# EAGLE design eeZeeTiny43U (EAGLE 7.1.0)
DATABASE: ./../../../EAGLE/PARTSDB.TXT
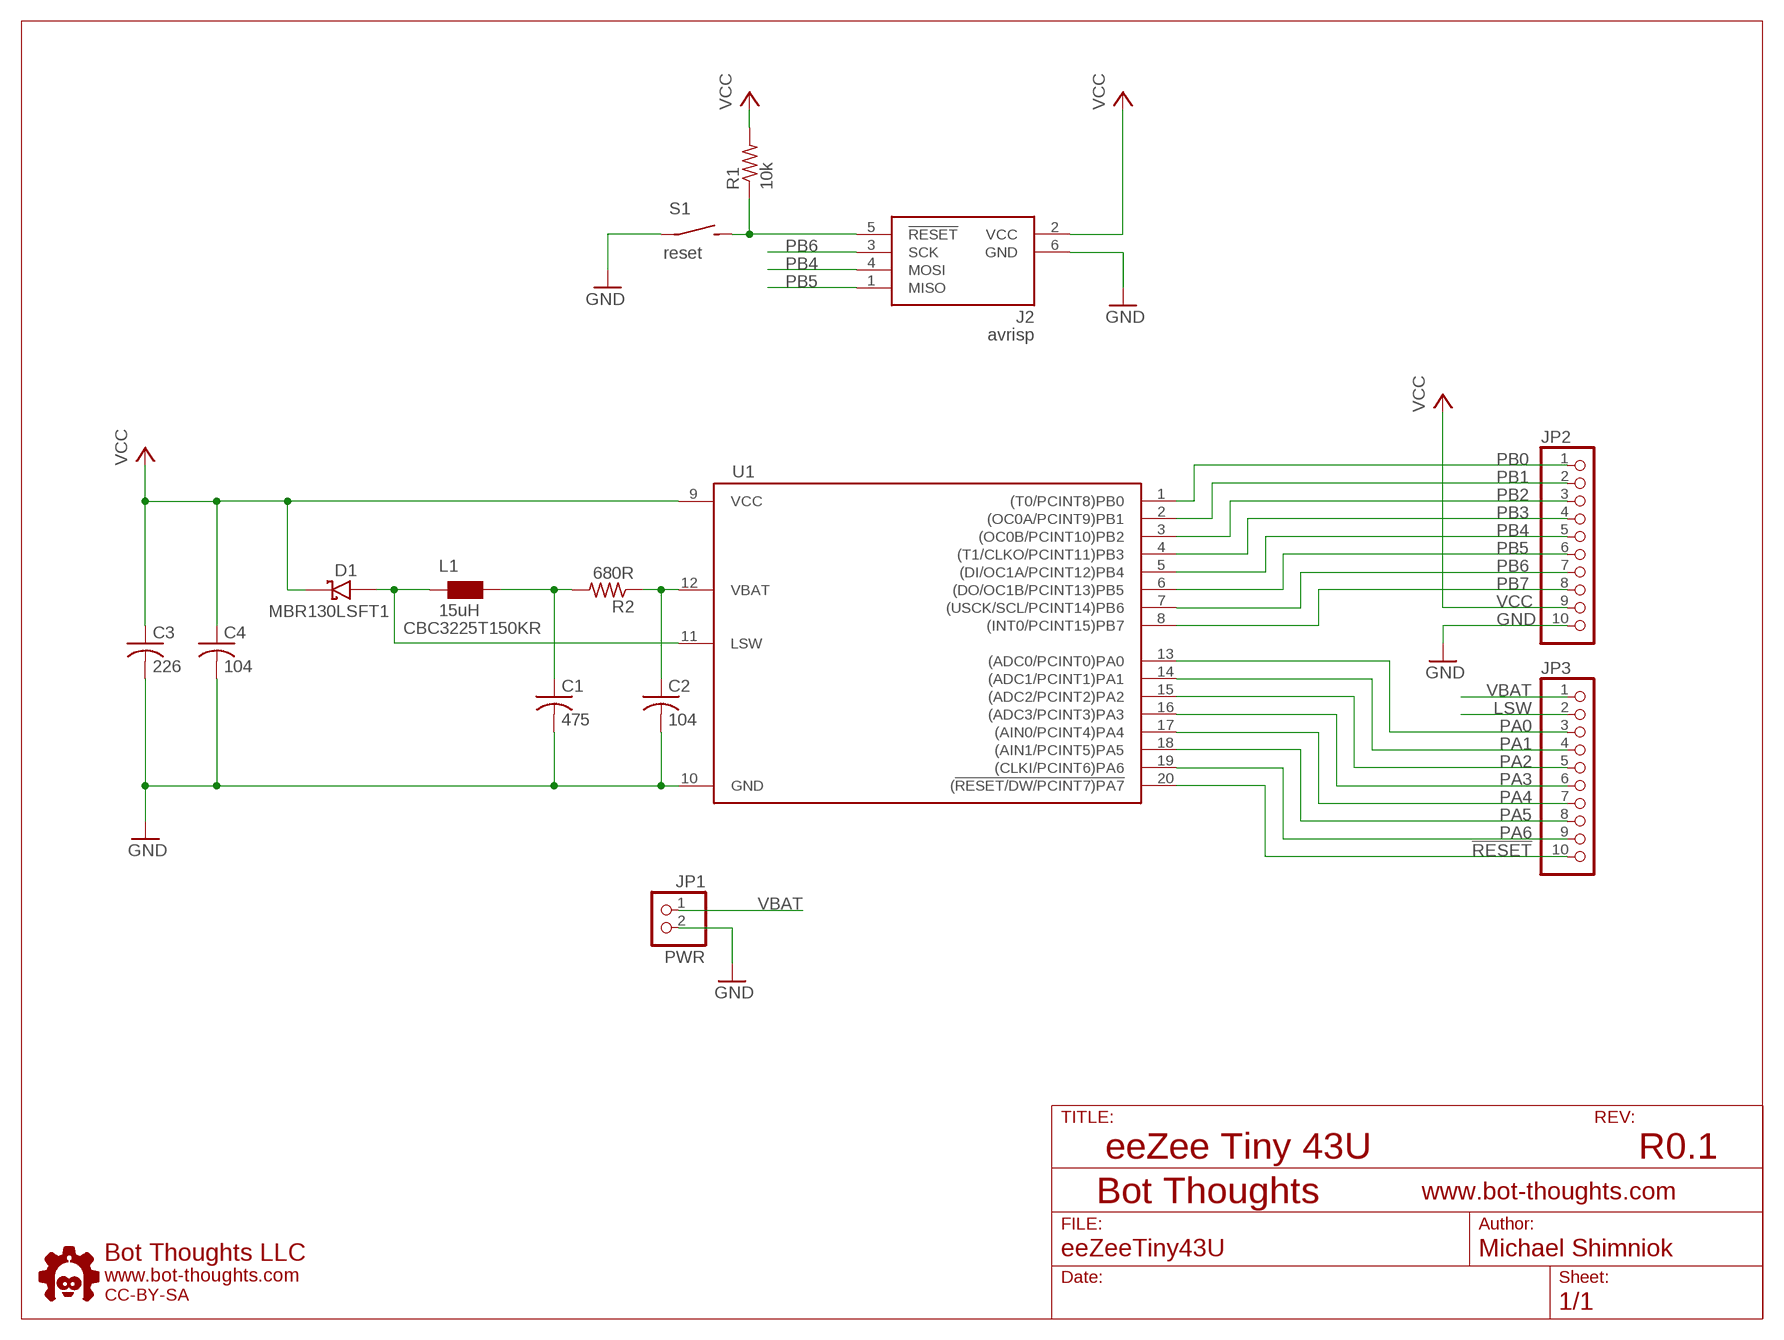
[diagram p0: schematic, sheet 1]

## Parts
C1  475  C-0603  [0603]
C2  104  C-0603  [0603]
C3  226  C-1206  [1206]
C4  104  C-0603  [0603]
D1  MBR130LSFT1  SCHOTTKY-DIODE-MBR130LSFT1  [SOD123FL]
J2  avrisp  AVRISP6_COMPACT  [CON6P2R]
JP1  PWR  PINHD-1X02_2.54-S  [1X02-S]
JP2  PINHD-1X10_2.54-S  [1X10-S]
JP3  PINHD-1X10_2.54-S  [1X10-S]
L1  15uH  WE-CBF_1210  [1210]
R1  10k  R0603  [0603]
R2  680R  R0603  [0603]
S1  reset  SPST_TAC_RECT1  [6MMTACTILE_RECT]
U1  ATTINY43U-SU  [SOIC20]
U$1  BTLOGO-LOGO-MD  [BTLOGOM]

## Nets
!RESET: J2.5(!RESET) JP3.10 R1.1 S1.P$2(S) U1.20((!RESET/DW/PCINT7)PA7)
GND: C1.2(-) C2.2(-) C3.2(-) C4.2(-) J2.6(GND) JP1.2 JP2.10 S1.P$1(P) U1.10(GND)
LSW: D1.A JP3.2 L1.1 U1.11(LSW)
PA0: JP3.3 U1.13((ADC0/PCINT0)PA0)
PA1: JP3.4 U1.14((ADC1/PCINT1)PA1)
PA2: JP3.5 U1.15((ADC2/PCINT2)PA2)
PA3: JP3.6 U1.16((ADC3/PCINT3)PA3)
PA4: JP3.7 U1.17((AIN0/PCINT4)PA4)
PA5: JP3.8 U1.18((AIN1/PCINT5)PA5)
PA6: JP3.9 U1.19((CLKI/PCINT6)PA6)
PB0: JP2.1 U1.1((T0/PCINT8)PB0)
PB1: JP2.2 U1.2((OC0A/PCINT9)PB1)
PB2: JP2.3 U1.3((OC0B/PCINT10)PB2)
PB3: JP2.4 U1.4((T1/CLKO/PCINT11)PB3)
PB4: J2.4(MOSI) JP2.5 U1.5((DI/OC1A/PCINT12)PB4)
PB5: J2.1(MISO) JP2.6 U1.6((DO/OC1B/PCINT13)PB5)
PB6: J2.3(SCK) JP2.7 U1.7((USCK/SCL/PCINT14)PB6)
PB7: JP2.8 U1.8((INT0/PCINT15)PB7)
VBAT: C2.1(+) JP1.1 JP3.1 R2.1 U1.12(VBAT)
VBAT1: C1.1(+) L1.2 R2.2
VCC: C3.1(+) C4.1(+) D1.C J2.2(VCC) JP2.9 R1.2 U1.9(VCC)

## Notes on the sheet
- eeZee Tiny 43U | R0.1

## Library data of the parts
C1 C2 C4 = bt_rcl:C: Capacitor, non-polarized, American symbol; BOM: EXCLUDE; PARTNO: 0603YC104KAT2A
C3 = bt_rcl:C: Capacitor, non-polarized, American symbol; BOM: EXCLUDE; PARTNO: MCTT21X106M6R3CT
D1 = bt_diode:SCHOTTKY-DIODE: Schottky Diode
J2 = bt_avr:AVRISP6: 6-pin dual-row connector for Atmel AVRISP programmer interface
JP1 = pinhead-2:PINHD-1X02: PIN HEADER
JP2 JP3 = pinhead-2:PINHD-1X10: PIN HEADER
L1 = wuerth-elektronik:WE-CBF: SMD EMI Suppression Ferrite Beads - excellent anti-EMI properties - low DCR - impedances till 3000 ohms - rated current up to 6 A; PARTNO: CBC3225T150KR
R1 R2 = bt_rcl:R: Resistor, American symbol; PARTNO: ERJ-3GEYJ103V
S1 = mes_electromech:SPST: SPST SWITCH
U1 = bt_avr:ATTINY43U: ATtiny43U The 20-pin, high-performance, ultra low-voltage 8-bit AVR RISC-based microcontroller combines 4KB flash memory, 64B EEPROM, 256B SRAM, 16 general purpose I/O lines, 32 general purpose working registers, two 8-bit timer/counters with two PWM channels, internal and external interrupts, a 4-channel 10-bit A/D converter, a universal serial interface (USI), programmable watchdog timer with internal oscillator, internal calibrated oscillator, and three software selectable power saving modes. Built-in boost voltage converter providing 3V to the processor while only requiring between 0.7-1.8 volts from its external power supply (1.8-5.5 volts when the voltage converter is bypassed). Datasheet.pdf <http://ww1.microchip.com/downloads/en/DeviceDoc/doc8048.pdf>
U$1 = bt:BTLOGO: Bot Thoughts Logo

## Board
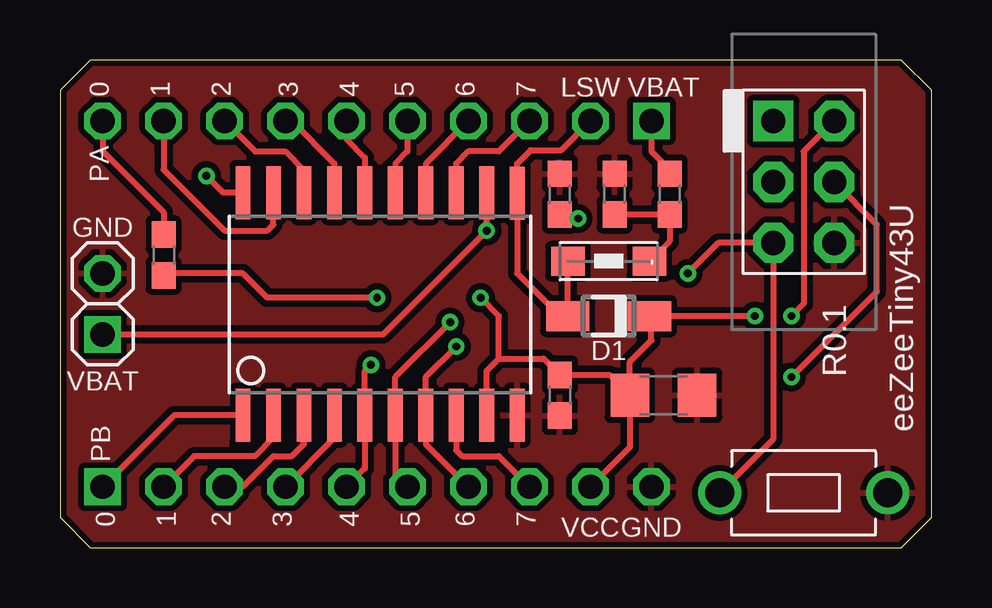
[diagram p1: board, top side]
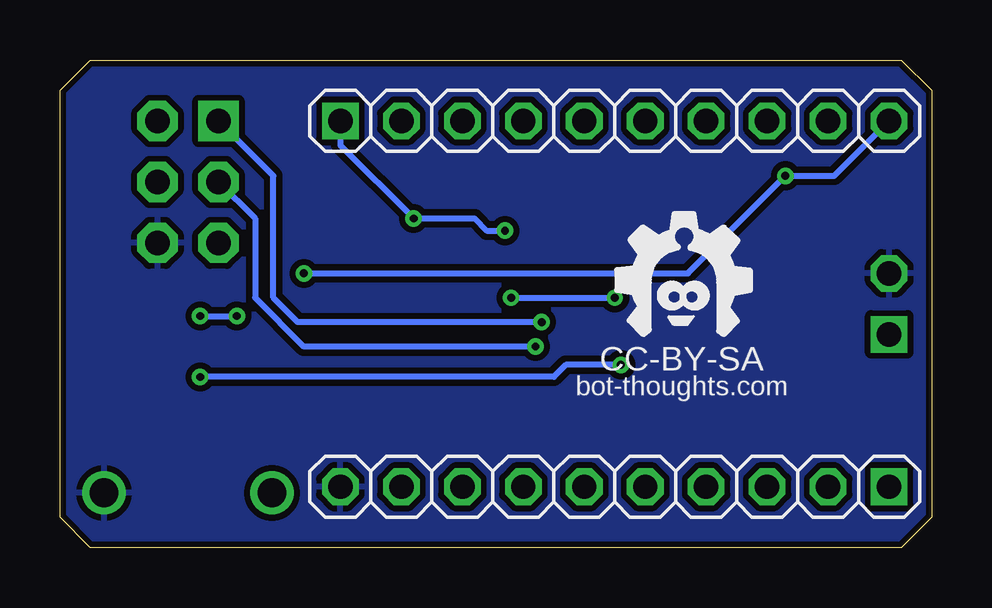
[diagram p2: board, bottom side, seen from below]

Size 36.32 x 20.32 mm. Coordinates in mm from the lower left corner, seen from the top.
Outline: 0,19.05 0,1.27 1.27,0 35.05,0 36.32,1.27 36.32,19.05 35.05,20.32 1.27,20.32 0,19.05
Copper layers (1*16): Top 0.0356mm / dielectric 1.5011mm / Bottom 0.0356mm
Design rules "LaenPCBOrder": minimum track width 6mil, minimum drill 13mil, track to track 10mil, track to pad 10mil, pad to pad 10mil, via to via 10mil, smd to smd 8mil, copper to edge 10mil, drill to drill 10mil, minimum pad ring 7mil, minimum via ring 7mil, stop-mask expansion 3mil, vias tented up to drill 20mil, thermal gap 10mil

### Footprints (pad centres in the part's own frame; a part is rotated, then mirrored left to right if it is on the bottom)
0603 = smd 1.1 x 1: 1 -0.85,0; 2 0.85,0
1206 = smd 1.6 x 1.8: 1 -1.4,0; 2 1.4,0
SOD123FL = smd 1.8 x 1.25: A 1.7,0; C -1.7,0
CON6P2R = drill 1.016 pad 1.676 square: 1 -2.54,-1.27 | drill 1.016 pad 1.676 octagon: 2 -2.54,1.27; 3 0,-1.27; 4 0,1.27; 5 2.54,-1.27; 6 2.54,1.27
1X02-S = drill 1.016 square: 1 -1.27,0 | drill 1.016 octagon: 2 1.27,0
1X10-S = drill 1.016 square: 1 -11.43,0 | drill 1.016 octagon: 2 -8.89,0; 3 -6.35,0; 4 -3.81,0; 5 -1.27,0; 6 1.27,0; 7 3.81,0; 8 6.35,0; 9 8.89,0; 10 11.43,0
1210 = smd 1.4 x 1.2: 1 -1.7,0; 2 1.7,0
6MMTACTILE_RECT = drill 1.2: P$1 -3.5,0; P$2 3.5,0
SOIC20 = smd 0.61 x 2.21: 1 -5.715,-4.636; 2 -4.445,-4.636; 3 -3.175,-4.636; 4 -1.905,-4.636; 5 -0.635,-4.636; 6 0.635,-4.636; 7 1.905,-4.636; 8 3.175,-4.636; 9 4.445,-4.636; 10 5.715,-4.636; 11 5.715,4.61; 12 4.445,4.636; 13 3.175,4.636; 14 1.905,4.636; 15 0.635,4.636; 16 -0.635,4.636; 17 -1.905,4.636; 18 -3.175,4.636; 19 -4.445,4.636; 20 -5.715,4.636

### Placement (x,y rotation side)
C1  23.11,14.73 90 top
C2  20.83,14.73 90 top
C3  25.15,6.35 0 top
C4  20.83,6.35 270 top
D1  22.86,9.65 180 top
J2  30.99,15.24 270 top
JP1  1.78,10.16 90 top
JP2  13.21,2.54 180 bottom
JP3  13.21,17.78 0 bottom
L1  22.86,11.94 0 top
R1  4.32,12.19 270 top
R2  25.4,14.73 270 top
S1  30.99,2.29 180 top
U1  13.34,10.16 0 top
U$1  10.41,8.64 0 bottom

### Tracks (layer width: path | path; a pad name or v marks a point on that pad's centre or on a via)
!RESET  (via drill 0.33)
  Top 0.254: S1.P$2 29.72,4.52 J2.5 27.43,12.7 v26.16,11.43 | JP3.10 1.78,16.51 4.32,13.97 R1.1 | U1.20 6.79,14.8 v6.1,15.49
  Bottom 0.254: JP3.10 4.06,15.49 v6.1,15.49 10.16,11.43 v26.16,11.43
GND
  pour Bottom: 0,20.32 36.32,20.32 36.32,0 0,0
  pour Top: 0,20.32 36.32,20.32 36.32,0 0,0
LSW
  Top 0.254: L1.1 D1.A 20.57,9.91 19.05,11.43 U1.11 19.05,16 19.61,16.56 20.88,16.56 JP3.2
PA0
  Top 0.254: JP3.3 18.29,16.51 17.02,16.51 16.51,16 U1.13
PA1
  Top 0.254: JP3.4 15.24,16 U1.14
PA2
  Top 0.254: JP3.5 14.48,16.51 13.97,16 U1.15
PA3
  Top 0.254: JP3.6 11.94,17.02 12.7,16.26 U1.16
PA4
  Top 0.254: JP3.7 9.65,17.78 11.43,16 U1.17
PA5
  Top 0.254: JP3.8 8.13,16.51 9.4,16.51 10.16,15.75 U1.18
PA6
  Top 0.254: JP3.9 4.32,15.75 6.86,13.21 8.64,13.21 8.89,13.46 U1.19
PB0
  Top 0.254: JP2.1 4.76,5.52 U1.1
PB1
  Top 0.254: U1.2 8.89,4.57 8.13,3.81 5.59,3.81 JP2.2
PB2
  Top 0.254: JP2.3 7.62,2.54 8.89,3.81 9.65,3.81 10.16,4.32 U1.3
PB3
  Top 0.254: U1.4 11.43,4.57 JP2.4
PB4  (via drill 0.33)
  Top 0.254: JP2.5 12.7,3.3 U1.5 12.7,7.37 v12.95,7.62 | v30.48,7.11 34.04,10.67 34.04,13.46 J2.4
  Bottom 0.254: v12.95,7.62 15.24,7.62 15.75,7.11 v30.48,7.11
PB5  (via drill 0.33)
  Top 0.254: JP2.6 13.97,3.05 U1.6 13.97,7.11 v16.26,9.4
  Bottom 0.254: v16.26,9.4 26.42,9.4 27.43,10.41 27.43,15.49 J2.1
PB6  (via drill 0.33)
  Top 0.254: JP2.7 15.24,4.32 U1.7 15.24,7.11 v16.51,8.38
  Bottom 0.254: v16.51,8.38 26.16,8.38 28.19,10.41 28.19,13.72 J2.3
PB7
  Top 0.254: U1.8 16.51,4.06 16.76,3.81 18.29,3.81 JP2.8
VBAT  (via drill 0.33)
  Top 0.254: JP3.1 24.64,16.51 25.4,15.75 R2.1 | JP1.1 13.46,8.89 v17.78,13.21 U1.12 | C2.1 20.92,13.88 21.08,13.72 v21.59,13.72
  Bottom 0.254: JP3.1 24.64,16.76 v21.59,13.72 19.05,13.72 18.54,13.21 v17.78,13.21
VBAT1
  Top 0.254: C1.1 R2.2 25.4,12.78 L1.2
VCC  (via drill 0.33)
  Top 0.254: U1.9 17.78,7.37 18.29,7.87 | 18.29,7.87 20.15,7.87 C4.1 22.9,7.2 C3.1 | 18.29,7.87 18.29,9.65 v17.53,10.41 | v13.21,10.41 8.64,10.41 7.62,11.43 4.48,11.43 R1.2 | J2.2 30.99,16.51 30.99,10.16 v30.48,9.65 | v28.96,9.65 D1.C 24.64,9.57 24.64,8.64 23.75,7.74 C3.1 | C3.1 23.75,4.19 JP2.9
  Bottom 0.254: v17.53,10.41 v13.21,10.41 | v30.48,9.65 v28.96,9.65

### Text on the board
tNames: 0 | 1 | 2 | 3 | 4 | 5 | 6 | 7 | LSW | VBAT | PA | GND | VBAT | R0.1 | eeZeeTiny43U | PB | 0 | 1 | 2 | 3 | 4 | 5 | 6 | 7 | VCC | GND
bNames: CC-BY-SA | bot-thoughts.com
tsilk: PA0 | PA1 | PA2 | PA3 | PA4 | PA5 | GND | Rev 0.1A | ATtiny841 | reset | VCC | eeZeeTiny841 | PB0 | PB1 | PB3 | PB2 | PA7 | PA6
bsilk: bot-thoughts.com